# Altium schematic sheet Step Up Converter_rev_final.SchDoc
size A; SheetNumber: 1; SheetTotal: 1
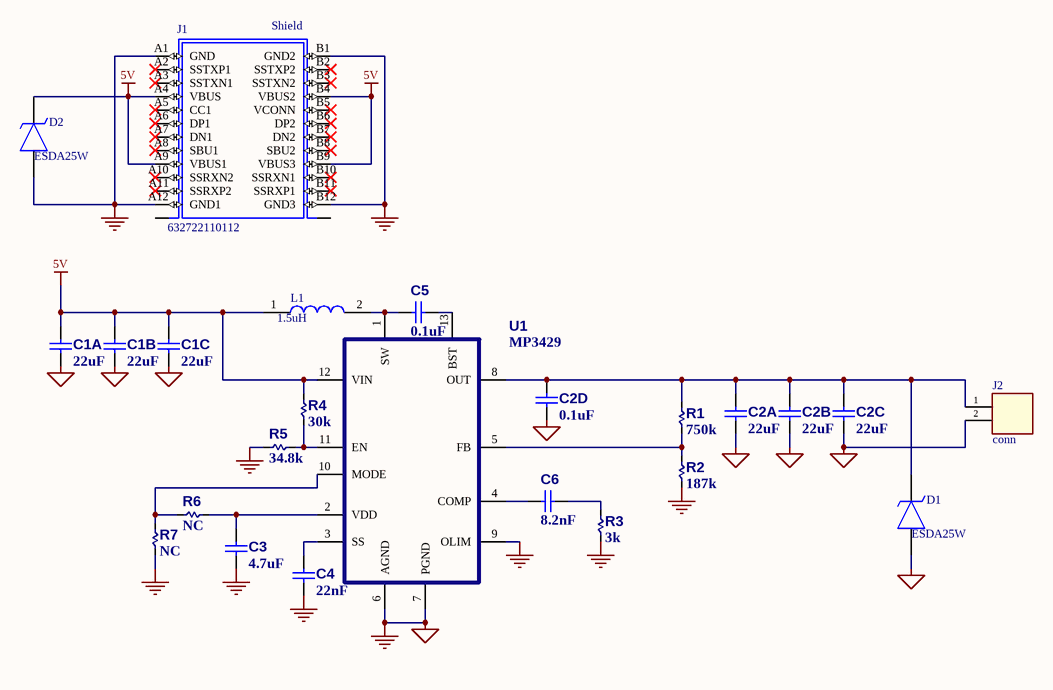
[diagram p0: Step Up Converter_rev_final.SchDoc]

## Parts
C1A  value 22uF  [CAPC3216X190N]  (hidden comment: Cap)
C1B  value 22uF  [CAPC3216X190N]  (hidden comment: Cap)
C1C  value 22uF  [CAPC3216X190N]  (hidden comment: Cap)
C2A  value 22uF  [CAPC3225X270N]  (hidden comment: Cap)
C2B  value 22uF  [CAPC3225X270N]  (hidden comment: Cap)
C2C  value 22uF  [CAPC3225X270N]  (hidden comment: Cap)
C2D  value 0.1uF  [CAPC3216X190N]  (hidden comment: Cap)
C3  value 4.7uF  [CAPC1608X90N]  (hidden comment: Cap)
C4  value 22nF  [CAPC1608X90N]  (hidden comment: Cap)
C5  value 0.1uF  [CAPC1608X90N]  (hidden comment: Cap)
C6  value 8.2nF  [CAPC1608X90N]  (hidden comment: Cap)
D1  ESDA25W  [SOT65P210X110-3N]
D2  ESDA25W  [SOT65P210X110-3N]
J1  632722110112  [632722110112]
J2  conn  [conn]
L1  1.5uH  [INDPM115100X400N]
R1  value 750k  [RESC1608X55N]  (hidden comment: RC(0603_50V0805_150V1206_200V2512_200V)
R2  value 187k  [RESC1608X55N]  (hidden comment: RC(0603_50V0805_150V1206_200V2512_200V)
R3  value 3k  [RESC1608X55N]  (hidden comment: RC(0603_50V0805_150V1206_200V2512_200V)
R4  value 30k  [RESC1608X55N]  (hidden comment: RC(0603_50V0805_150V1206_200V2512_200V)
R5  value 34.8k  [RESC1608X55N]  (hidden comment: RC(0603_50V0805_150V1206_200V2512_200V)
R6  value NC  [RESC1608X55N]  (hidden comment: RC(0603_50V0805_150V1206_200V2512_200V)
R7  value NC  [RESC1608X55N]  (hidden comment: RC(0603_50V0805_150V1206_200V2512_200V)
U1  MP3429  [FCQFN-13L(3mmx4mm)]

## Nets
5V: C1A.2 C1B.2 C1C.2 D2.1,2(K) J1.A4(VBUS) J1.A9(VBUS1) J1.B4(VBUS2) J1.B9(VBUS3) L1.1 R4.1 U1.12(VIN)
GND: C1A.1 C1B.1 C1C.1 C2A.1 C2B.1 C2C.1 C2D.1 C3.1 C4.2 D1.3(A) D2.3(A) J1.A1(GND) J1.A12(GND1) J1.B1(GND2) J1.B12(GND3) J2.2(GND) R2.1 R3.2 R5.2 R7.2 U1.6(AGND) U1.7(PGND) U1.9(OLIM)
NetC2A_2: C2A.2 C2B.2 C2C.2 C2D.2 D1.1,2(K) J2.1(VCC) R1.2 U1.8(OUT)
NetC3_2: C3.2 R6.1 U1.2(VDD)
NetC4_1: C4.1 U1.3(SS)
NetC5_1: C5.1 U1.13(BST)
NetC5_2: C5.2 L1.2 U1.1(SW)
NetC6_1: C6.1 R3.1
NetC6_2: C6.2 U1.4(COMP)
NetJ1_S1: J1.S1(SHIELD) J1.S2(SHIELD)
NetJ1_S3: J1.S3(SHIELD1) J1.S4(SHIELD1)
NetR1_1: R1.1 R2.2 U1.5(FB)
NetR4_2: R4.2 R5.1 U1.11(EN)
NetR6_2: R6.2 R7.1 U1.10(MODE)

Not connected (* = marked no-connect by the designer): J1 A2(SSTXP1)* A3(SSTXN1)* A5(CC1)* A6(DP1)* A7(DN1)* A8(SBU1)* A10(SSRXN2)* A11(SSRXP2)* B2(SSTXP2)* B3(SSTXN2)* B5(VCONN)* B6(DP2)* B7(DN2)* B8(SBU2)* B10(SSRXN1)* B11(SSRXP1)*

## Notes on the sheet
- (in symbol 632722110112) Shield

## Library data of the parts
C1A C1B C1C = Cap: 16V, ceramic Capacitor; Manufacturer: muRata; Manufacturer P/N: GRM32R71C476KL; Package: 1210
C2A C2B C2C = Cap: 25V, ceramic Capacitor; Manufacturer: muRata; Manufacturer P/N: GRM32R71E226KL; Package: 1210
C2D = Cap: 25V, ceramic Capacitor; Manufacturer: muRata; Manufacturer P/N: GRM21AR71E105KL; Package: 0805
C3 = Cap: 25V, ceramic Capacitor; Manufacturer: muRata; Manufacturer P/N: GRM21AR71E475KL; Package: 0805
C4 = Cap: 50V ceramic capacitor; Manufacturer: muRata; Manufacturer P/N: GRM188R71H223KL; Package: 0603
C5 = Cap: 50V, ceramic Capacitor; Manufacturer: muRata; Manufacturer P/N: GRM21AR71H104KL; Package: 0805
C6 = Cap: 50V ceramic capacitor; Manufacturer: muRata; Manufacturer P/N: GRM188R71H472KL; Package: 0603
D1 D2 = ESDA25W: Diode; Manufacturer_Name: STMicroelectronics; Datasheet Link: https://componentsearchengine.com//ESDA25W.pdf; Height: 1.1mm; Mouser2 Part Number: 511-ESDA25W; Mouser2 Price/Stock: https://www.mouser.com/Search/Refine.aspx?Keyword=511-ESDA25W
  D1: Manufacturer_Part_Number: ESDA25W
  D2: Manufacturer P/N: ESDA25W
J1 = 632722110112: USB-C (USB TYPE-C) USB 3.1 (USB 3.1 Gen 2, Superspeed+) Receptacle Connector 24 Position Surface Mount, Through Hole; MF: Wurth Electronics; Value: *; Availability: Warning; SnapEDA_Link: https://www.snapeda.com/parts/632722110112/Wurth%20Electronics%20Inc./view-part/3596593/?ref=snap; Mouser-Purchase-URL: https://snapeda.com/shop?store=Mouser&id=3596593; Package: None; DigiKey-Purchase-URL: https://snapeda.com/shop?store=DigiKey&id=3596593; Manufacturer P/N: 632722110112; Price: None
L1 = 104CDMCCDS-220MC: Inductor; Manufacturer_Name: Sumida; Datasheet Link: https://componentsearchengine.com//104CDMCCDS-220MC.pdf; Height: 4mm; Mouser2 Part Number: 851-104CDMCCDS-220MC; Mouser2 Price/Stock: https://www.mouser.com/Search/Refine.aspx?Keyword=851-104CDMCCDS-220MC; Manufacturer_Part_Number: 104CDMCCDS-220MC
R1 R6 R7 = SMR: Film resistor, 1%; Manufacturer: YAGEO; Manufacturer P/N: RC0603FR-07330KL; Package: 0603
R2 = SMR: Film resistor, 1%; Manufacturer: YAGEO; Manufacturer P/N: RC0603FR-0741K2L; Package: 0603
R3 = SMR: Film resistor, 5%; Manufacturer: YAGEO; Manufacturer P/N: RC0603FR-0710KL; Package: 0603
R4 = SMR: Film resistor, 5%; Manufacturer: YAGEO; Manufacturer P/N: RC0603FR-0727KL; Package: 0603
R5 = SMR: Film resistor, 5%; Package: 0603
U1 = MP3429: 16V,17A Synchronous Boost  with Programmable Output Current Limit; Manufacturer: MPS; Manufacturer P/N: MP3429GL; Package: QFN-13(3mmx4mm); Value: MP3429